# EAGLE schematic new_reg (EAGLE 9.2.2)
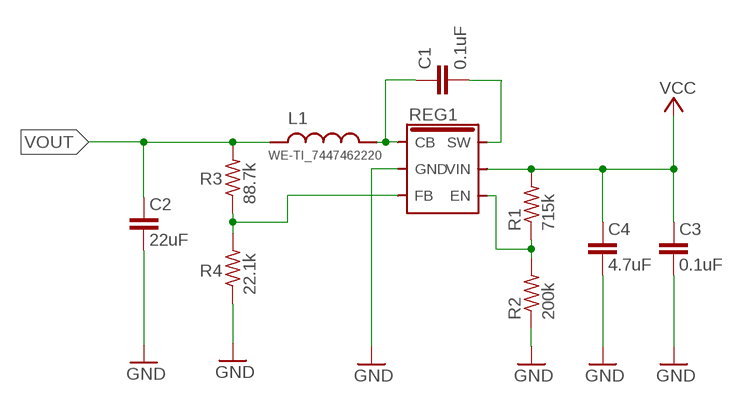
[diagram p0: schematic, sheet 1]

## Parts
C1  0.1uF  C-EUC0603  [C0603]
C2  22uF  C-EUC0603  [C0603]
C3  0.1uF  C-EUC0603  [C0603]
C4  4.7uF  C-EUC0603  [C0603]
L1  WE-TI_7447462220  [WE-TI_5075]
R1  715k  R-US_R0603  [R0603]
R2  200k  R-US_R0603  [R0603]
R3  88.7k  R-US_R0603  [R0603]
R4  22.1k  R-US_R0603  [R0603]
REG1  LMR50410  [SOT-23-6]

## Nets
GND: C2.2 C3.2 C4.2 R2.1 R4.1 REG1.P$2(GND)
N$1: R1.1 R2.2 REG1.P$4(EN)
N$2: R3.1 R4.2 REG1.P$3(FB)
N$3: C1.2 REG1.P$6(SW)
N$4: C1.1 L1.P$2 REG1.P$1(CB)
VCC: C3.1 C4.1 R1.2 REG1.P$5(VIN)
VOUT: C2.1 L1.P$1 R3.2

## Library data of the parts
C1-C4 = rcl:C-EU: CAPACITOR, European symbol; SPICEPREFIX: C
L1 = jmolterLib:WE-TI_7447462220: WE-TI Radial Leaded Wire Wound Inductor Part: 7447462220 22uH 1.7A 0.1ohm
R1-R4 = rcl:R-US_: RESISTOR, American symbol; SPICEPREFIX: R
REG1 = jmolterLib:LMR50410: Buck Converter 4V-36V Simple Switcher 1A Continuous Current 700kHz Precision Enable SOT-23-6